# EAGLE design ardOnTimer (EAGLE 9.5.2)
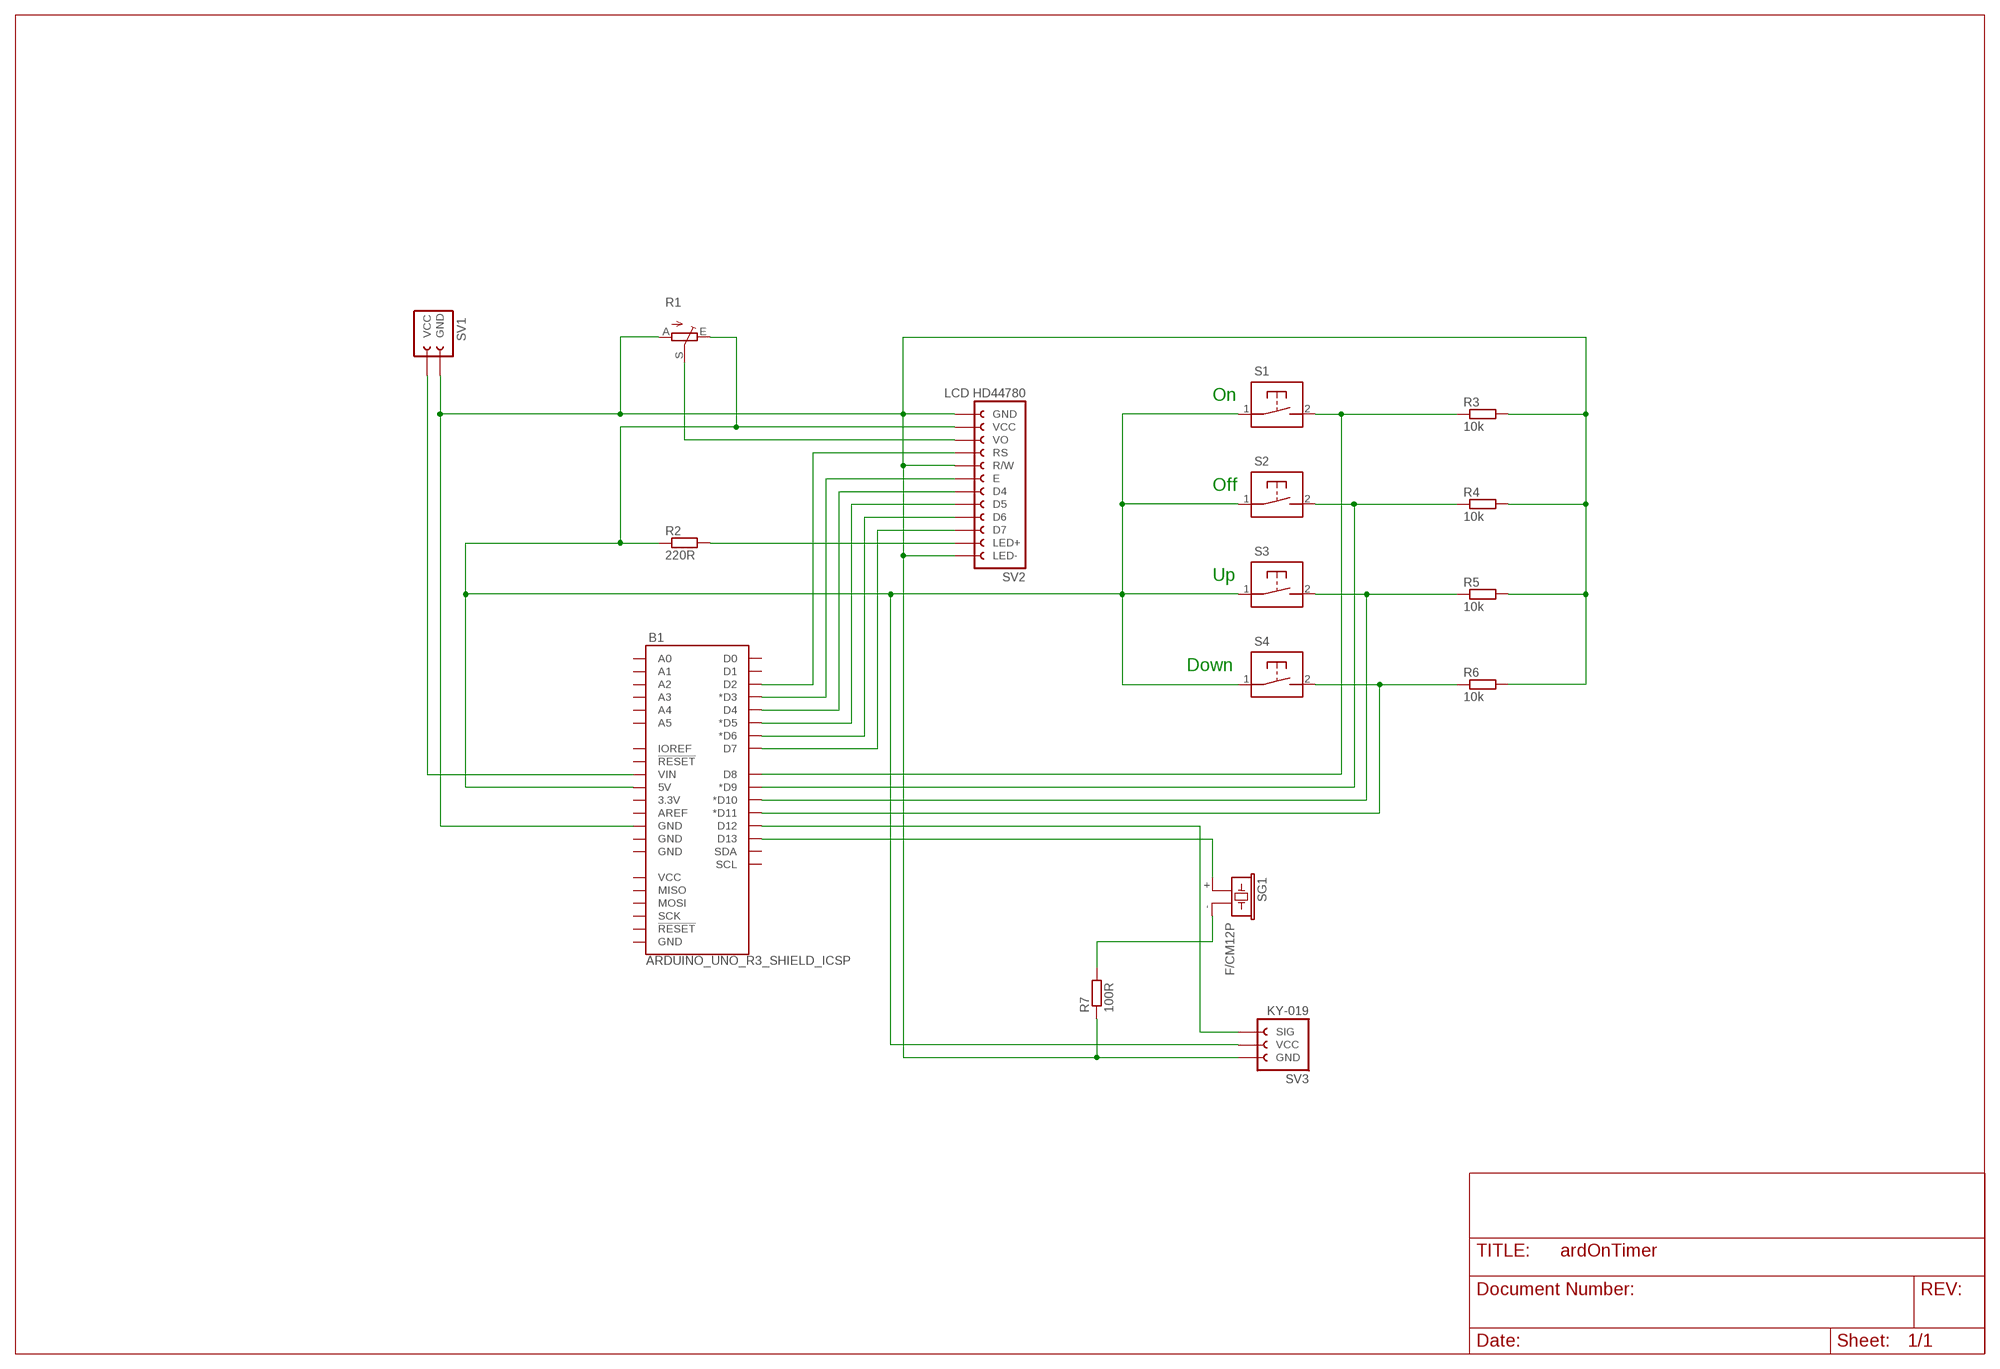
[diagram p0: schematic, sheet 1]

## Parts
B1  ARDUINO_UNO_R3_SHIELD_ICSP  [UNO_R3_SHIELD_ICSP]
R1  POTENTIOMETER_CA6VCA6V  [CA6V]
R2  220R  R-EU_0204/7  [0204/7]
R3  10k  R-EU_0204/7  [0204/7]
R4  10k  R-EU_0204/7  [0204/7]
R5  10k  R-EU_0204/7  [0204/7]
R6  10k  R-EU_0204/7  [0204/7]
R7  100R  R-EU_0204/7  [0204/7]
S1  NO_SWITCH_2-PIN-FEMALE_HEADER  [NO_SWITCH_2-PIN-FEMALE_HEADER]
S2  NO_SWITCH_2-PIN-FEMALE_HEADER  [NO_SWITCH_2-PIN-FEMALE_HEADER]
S3  NO_SWITCH_2-PIN-FEMALE_HEADER  [NO_SWITCH_2-PIN-FEMALE_HEADER]
S4  NO_SWITCH_2-PIN-FEMALE_HEADER  [NO_SWITCH_2-PIN-FEMALE_HEADER]
SG1  F/CM12P  [F/CM12P]
SV1  POWER_IN-2-PIN_FEMALE_HEADER  [POWER_IN-2-PIN_FEMALE_HEADER]
SV2  LCD-HD44780-12-PIN_FEMALE_HEADER  [LCD-HD44780-12-PIN_FEMALE_HEADER]
SV3  KY-019_3-PIN_FEMALE_HEADERANGLED_W_MOUNT_HOLES  [KY-019_3-PIN_FEMALE_HEADER_ANGLED_W_MOUNT_HOLES]

## Nets
N$1: B1.GND@2(GND) R1.A R3.2 R4.2 R5.2 R6.2 R7.1 SV1.GND SV2.GND SV2.LED- SV2.R/W SV3.GND
N$2: B1.D13 SG1.+
N$3: R1.S SV2.VO
N$4: R2.2 SV2.LED+
N$5: B1.D2 SV2.RS
N$6: B1.D3(*D3) SV2.E
N$7: B1.D4 SV2.D4
N$8: B1.D5(*D5) SV2.D5
N$9: B1.D6(*D6) SV2.D6
N$10: B1.D7 SV2.D7
N$11: B1.VIN SV1.VCC
N$12: B1.5V R1.E R2.1 S1.1(P) S2.1(P) S3.1(P) S4.1(P) SV2.VCC SV3.VCC
N$13: B1.D8 R3.1 S1.2(S)
N$14: B1.D9(*D9) R4.1 S2.2(S)
N$15: B1.D10(*D10) R5.1 S3.2(S)
N$16: B1.D11(*D11) R6.1 S4.2(S)
N$17: B1.D12 SV3.SIG
N$18: R7.2 SG1.-
Unconnected: B1.3.3V B1.5V_ICSP(VCC) B1.A0 B1.A1 B1.A2 B1.A3 B1.A4 B1.A5 B1.AREF B1.GND@0(GND) B1.GND@1(GND) B1.GND_ICSP(GND) B1.IOREF B1.MISO B1.MOSI B1.RES(!RESET!) B1.RST_ICSP(!RESET!) B1.RX(D0) B1.SCK B1.SCL B1.SDA B1.TX(D1)

## Notes on the sheet
- On
- Off
- Up
- Down

## Library data of the parts
B1 = myLib-02-Arduino:ARDUINO_UNO_R3_SHIELD_ICSP: Arduino R3 Shield Footprint with ICSP Header Includes pins for 6-pin (2x3) ICSP Header. Compatible with Leonardo boards that require SPI pin connections via this header. SparkFun Products: CryptoShield <https://www.sparkfun.com/products/13183> microSD Shield <https://www.sparkfun.com/products/12761> R3 Stackable Headers Kit <https://www.sparkfun.com/products/1417>
R1 = myLib-04-OftenUsed:POTENTIOMETER_CA6V: TRIM POTENTIOMETER Trim Potentiometer CA6V
R2-R7 = rcl:R-EU_: RESISTOR, European symbol; SPICEPREFIX: R
S1-S4 = myLib-01-Headers:NO_SWITCH_2-PIN-FEMALE_HEADER: NO SWITCH FEMALE HEADER Normally open switch connected to a two pin header NO switch 2-pin header; MPN: B3F-3100; OC_FARNELL: 959704; OC_NEWARK: 36M3582
SG1 = buzzer:F/CM12P: BUZZER Source: Buerklin; OC_FARNELL: unknown; OC_NEWARK: unknown
SV1 = myLib-01-Headers:POWER_IN-2-PIN_FEMALE_HEADER: FEMALE HEADER
SV2 = myLib-01-Headers:LCD-HD44780-12-PIN_FEMALE_HEADER: Header for the 16 pin HD44780 LCD module Female 12-pin used
SV3 = myLib-01-Headers:KY-019_3-PIN_FEMALE_HEADER: Header for the 3 pin KY-019 arduino relay module Female https://www.keyestudio.com/free-shipping-keyestudio-single-5v-relay-module-compatible-with-arduino-uno-r3-mega-p0195-p0195.html https://tkkrlab.nl/wiki/Arduino_KY-019_5V_relay_module Board size: 27 x 34 mm Hole distances: 20.05 x 29 mm Lower edge to lower holes and in pins: 3 mm Hole diameter: 3.5 mm Lower left hole to Sig pin: 11 mm - pin to lower right hole: 4.5 mm Pins reaches 5 mm outside board edge

## Board
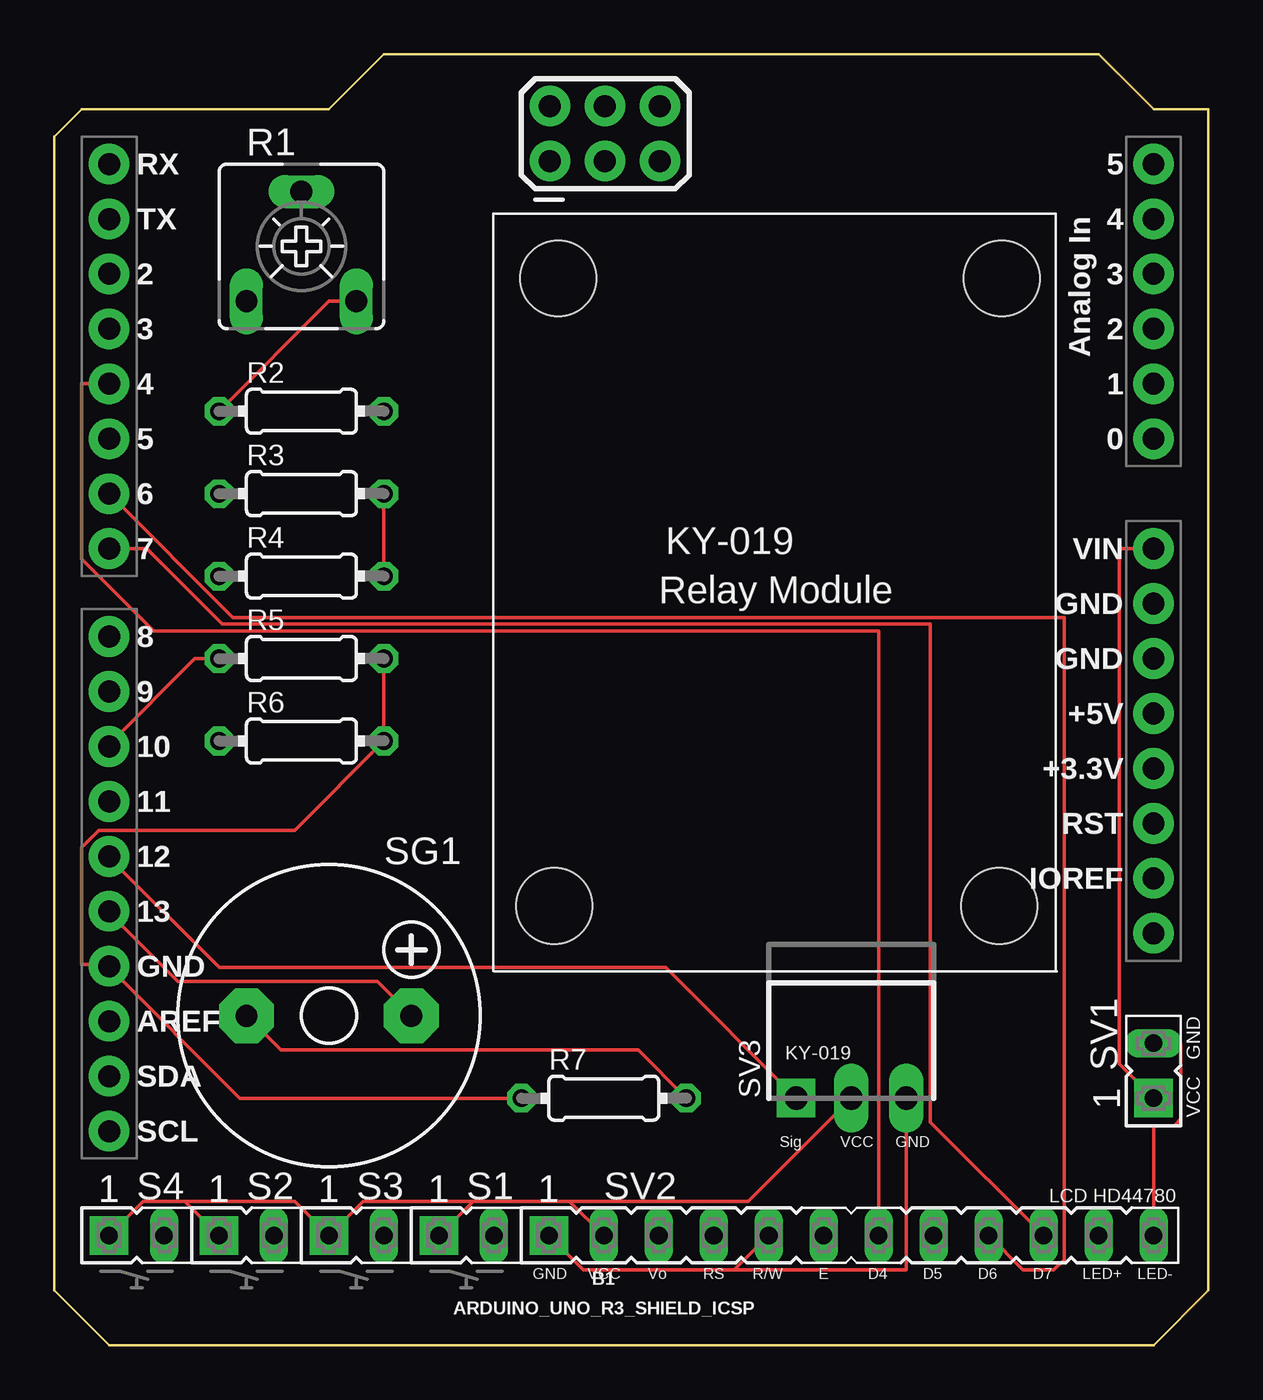
[diagram p1: board, top side]
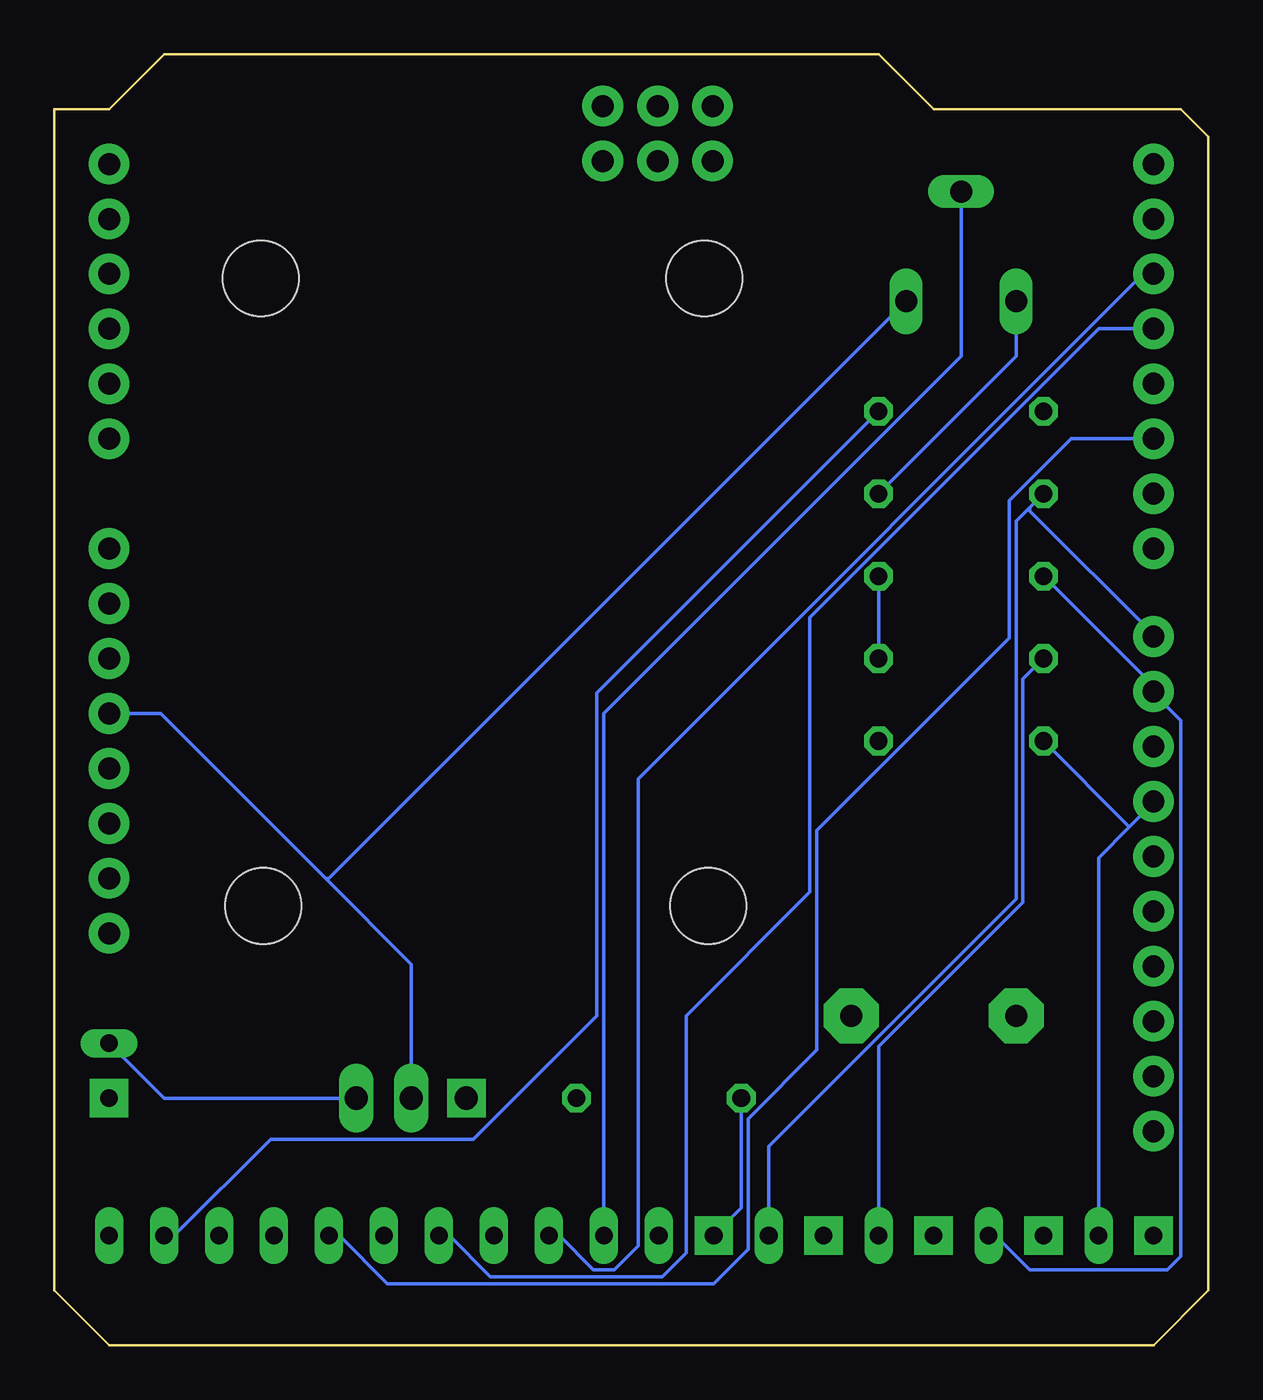
[diagram p2: board, bottom side, seen from below]

Size 53.34 x 59.69 mm. Coordinates in mm from the lower left corner, seen from the top.
Copper layers (1*16): Top 0.035mm / dielectric 1.5mm / Bottom 0.035mm
Design rules "default": minimum track width 6mil, minimum drill 0.35mm, track to track 6mil, track to pad 6mil, pad to pad 6mil, via to via 6mil, smd to smd 6mil, copper to edge 40mil, drill to drill 6mil, minimum pad ring 10mil, minimum via ring 8mil, stop-mask expansion 4mil, vias tented up to drill 0mil, thermal gap 10mil

### Footprints (pad centres in the part's own frame; a part is rotated, then mirrored left to right if it is on the bottom)
UNO_R3_SHIELD_ICSP = drill 1.016 pad 1.88: 3.3V 24.13,-3.81; 5V 24.13,-1.27; 5V_ICSP -3.76,26.81; A0 24.13,11.43; A1 24.13,13.97; A2 24.13,16.51; A3 24.13,19.05; A4 24.13,21.59; A5 24.13,24.13; AREF -24.13,-15.494; D2 -24.13,19.05; D3 -24.13,16.51; D4 -24.13,13.97; D5 -24.13,11.43; D6 -24.13,8.89; D7 -24.13,6.35; D8 -24.13,2.286; D9 -24.13,-0.254; D10 -24.13,-2.794; D11 -24.13,-5.334; D12 -24.13,-7.874; D13 -24.13,-10.414; GND@0 24.13,1.27; GND@1 24.13,3.81; GND@2 -24.13,-12.954; GND_ICSP 1.32,26.81; IOREF 24.13,-8.89; MISO -3.76,24.27; MOSI -1.22,26.81; NC 24.13,-11.43; RES 24.13,-6.35; RST_ICSP 1.32,24.27; RX -24.13,24.13; SCK -1.22,24.27; SCL -24.13,-20.574; SDA -24.13,-18.034; TX -24.13,21.59; VIN 24.13,6.35
CA6V = drill 1.016 long: A -2.54,-2.54; E 2.54,-2.54; S 0,2.54
0204/7 = drill 0.813 octagon: 1 -3.81,0; 2 3.81,0
NO_SWITCH_2-PIN-FEMALE_HEADER = drill 0.813 pad 1.778 square: 1 0,0 | drill 0.813 long: 2 2.54,0
F/CM12P = drill 1.016 pad 2.54 octagon: + 3.81,0; - -3.81,0
POWER_IN-2-PIN_FEMALE_HEADER = drill 0.813 long: GND 2.54,0 | drill 0.813 pad 1.778 square: VCC 0,0
LCD-HD44780-12-PIN_FEMALE_HEADER = drill 0.813 long: D4 15.24,0; D5 17.78,0; D6 20.32,0; D7 22.86,0; E 12.7,0; LED+ 25.4,0; LED- 27.94,0; R/W 10.16,0; RS 7.62,0; VCC 2.54,0; VO 5.08,0 | drill 0.813 pad 1.778 square: GND 0,0
KY-019_3-PIN_FEMALE_HEADER_ANGLED_W_MOUNT_HOLES = drill 1.067 long: GND 5.08,0; VCC 2.54,0 | drill 1.067 pad 1.778 square: SIG 0,0 | hole 3.5: -11.176,8.89; 9.39,8.89; -11,37.89; 9.5,37.89

### Placement (x,y rotation side)
B1  26.67,30.48 0 top
R1  11.43,50.8 0 top
R2  11.43,43.18 0 top
R3  11.43,39.37 0 top
R4  11.43,35.56 0 top
R5  11.43,31.75 0 top
R6  11.43,27.94 0 top
R7  25.4,11.43 0 top
S1  17.78,5.08 0 top
S2  7.62,5.08 0 top
S3  12.7,5.08 0 top
S4  2.54,5.08 0 top
SG1  12.7,15.24 0 top
SV1  50.8,11.43 90 top
SV2  22.86,5.08 0 top
SV3  34.29,11.43 0 top

### Tracks (layer width: path | path; a pad name or v marks a point on that pad's centre or on a via)
N$1
  Top 0.152: R5.2 R6.2 11.11,23.81 2.06,23.81 1.27,23.02 1.27,17.62 2.54,17.62 B1.GND@2 2.54,17.46 8.57,11.43 R7.1 | R3.2 R4.2 | SV2.LED- 50.8,10.16 51.75,10.16 52.07,10.48 52.07,13.97 SV1.GND | 31.43,3.49 SV2.R/W | 31.43,3.49 24.45,3.49 SV2.GND | SV3.GND 39.37,3.49 31.43,3.49
  Bottom 0.152: R1.A 8.89,45.72 R3.2 | R4.2 R5.2 | SV3.GND 48.26,11.43 SV1.GND | R7.1 21.59,6.35 SV2.GND
N$2
  Top 0.152: SG1.+ 14.92,16.83 5.71,16.83 2.54,20 B1.D13
N$3
  Bottom 0.152: SV2.VO 27.94,29.21 11.43,45.72 R1.S
N$4
  Bottom 0.152: SV2.LED+ 47.78,5.08 43.34,9.53 33.97,9.53 28.26,15.24 28.26,30.16 R2.2
N$5
  Bottom 0.152: SV2.RS 30,5.08 28.42,3.49 27.46,3.49 26.35,4.6 26.35,26.19 3.02,49.53 B1.D2
N$6
  Bottom 0.152: SV2.E 35.08,5.08 33.18,3.17 25.24,3.17 24.13,4.29 24.13,15.24 18.41,20.95 18.41,33.66 5.08,46.99 B1.D3
N$7
  Top 0.152: SV2.D4 38.1,33.02 4.6,33.02 1.27,36.35 1.27,44.45 B1.D4
N$8
  Bottom 0.152: SV2.D5 40.16,5.08 37.94,2.86 22.86,2.86 21.27,4.45 21.27,10.48 18.1,13.65 18.1,23.81 9.21,32.7 9.21,39.05 6.35,41.91 B1.D5
N$9
  Top 0.152: SV2.D6 44.77,3.49 46.2,3.49 46.67,3.97 46.67,33.66 8.26,33.66 B1.D6
N$10
  Top 0.152: SV2.D7 40.48,10.32 40.48,33.34 7.78,33.34 4.29,36.83 B1.D7
N$11
  Top 0.152: SV1.VCC 49.21,13.02 49.21,36.83 B1.VIN
N$12
  Top 0.152: S4.1 4.13,6.67 6.03,6.67 | S2.1 6.03,6.67 | 6.03,6.67 11.11,6.67 S3.1 14.29,6.67 19.37,6.67 | R2.1 12.7,48.26 R1.E | 23.81,6.67 SV2.VCC | 19.37,6.67 23.81,6.67 | S1.1 19.37,6.67 | SV3.VCC 32.07,6.67 23.81,6.67
  Bottom 0.152: B1.5V 48.42,29.21 40.8,21.59 | 40.8,21.59 36.83,17.62 SV3.VCC | R1.E 40.64,21.59 40.8,21.59
N$13
  Bottom 0.152: S1.2 20.32,9.21 8.89,20.64 8.89,38.1 8.26,38.73 | R3.1 8.26,38.73 | 8.26,38.73 8.26,38.58 2.54,32.86 B1.D8
N$14
  Bottom 0.152: S2.2 9.84,5.08 8.26,3.49 1.91,3.49 1.27,4.13 1.27,28.89 2.54,30.16 B1.D9 2.54,30.48 R4.1
N$15
  Top 0.152: R5.1 6.51,31.75 2.54,27.78 B1.D10
  Bottom 0.152: S3.2 15.24,13.81 8.57,20.48 8.57,30.8 R5.1
N$16
  Bottom 0.152: S4.2 5.08,22.54 3.65,23.97 | 3.65,23.97 2.54,25.08 B1.D11 | 3.65,23.97 R6.1
N$17
  Top 0.152: SV3.SIG 28.26,17.46 7.62,17.46 2.54,22.54 B1.D12
N$18
  Top 0.152: R7.2 26.99,13.65 10.48,13.65 SG1.-